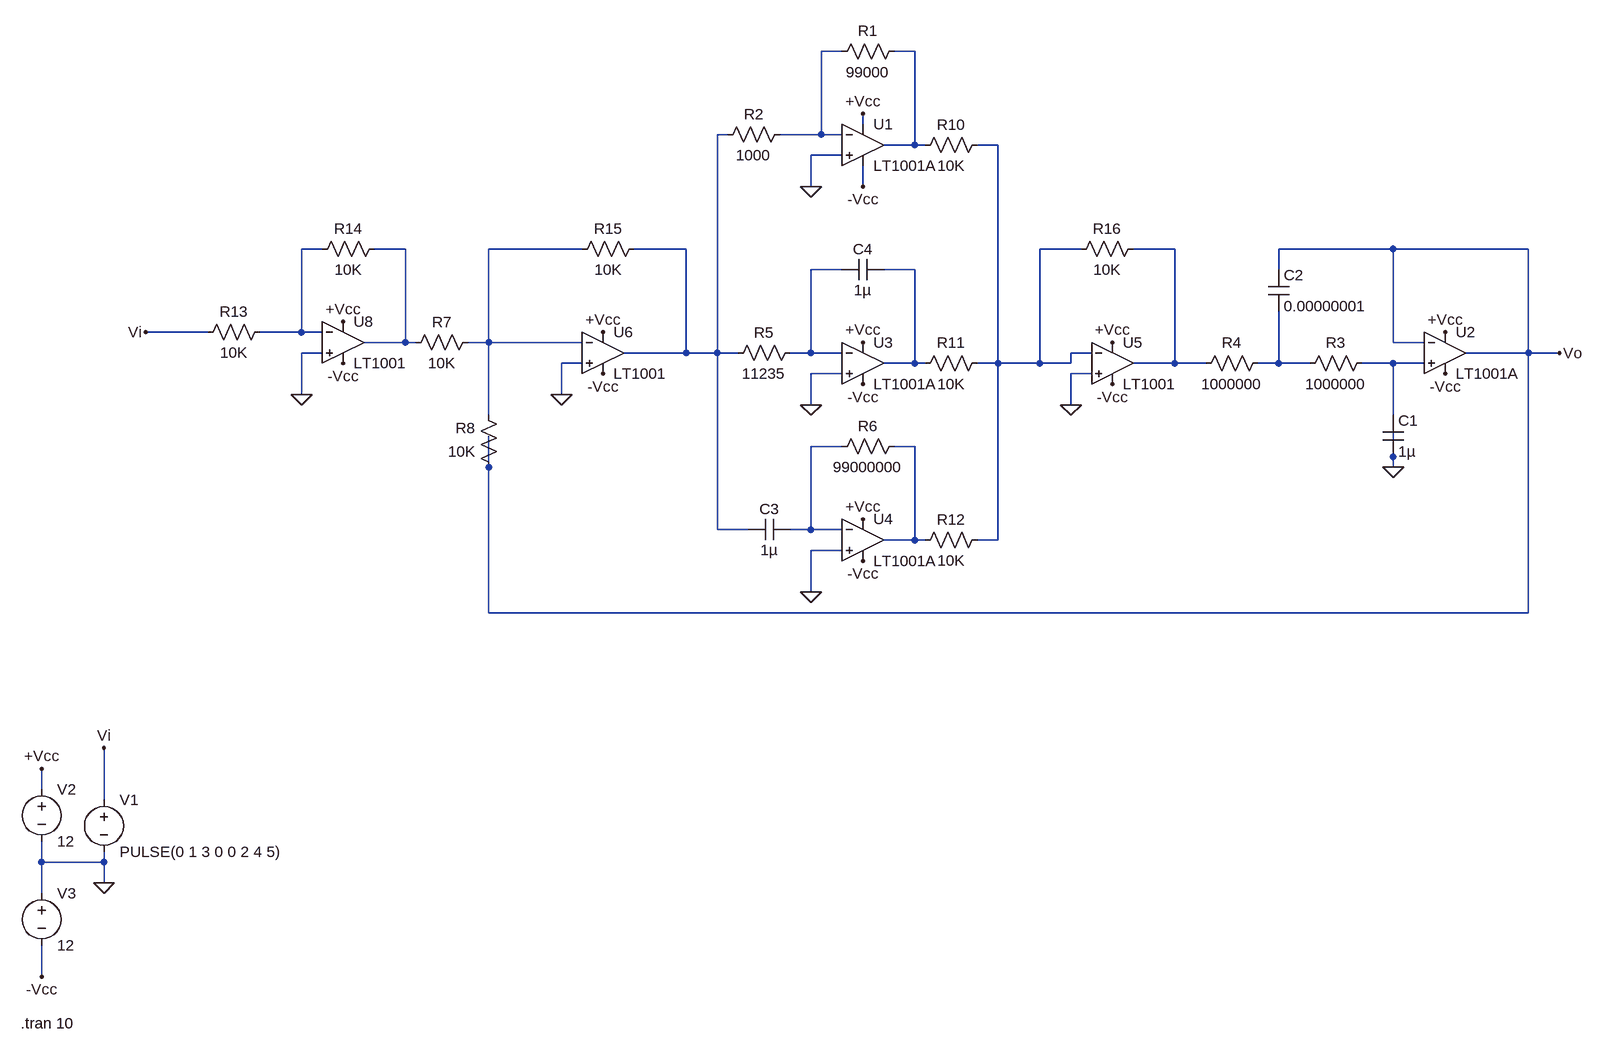
[diagram p0: schematic Circuitos_PID.asc]
Circuitos_PID.asc, the LTspice schematic file:
Version 4
SHEET 1 1532 1424
WIRE -576 -96 -608 -96
WIRE -464 -96 -496 -96
WIRE -544 16 -544 0
WIRE -752 32 -768 32
WIRE -608 32 -608 -96
WIRE -608 32 -672 32
WIRE -576 32 -608 32
WIRE -464 48 -464 -96
WIRE -464 48 -512 48
WIRE -448 48 -464 48
WIRE -336 48 -368 48
WIRE -576 64 -624 64
WIRE -624 112 -624 64
WIRE -544 112 -544 80
WIRE -1376 208 -1408 208
WIRE -1248 208 -1296 208
WIRE -976 208 -1120 208
WIRE -816 208 -896 208
WIRE -208 208 -272 208
WIRE -64 208 -128 208
WIRE 272 208 96 208
WIRE 480 208 272 208
WIRE -576 240 -624 240
WIRE -464 240 -512 240
WIRE 96 240 96 208
WIRE -1552 336 -1648 336
WIRE -1408 336 -1408 208
WIRE -1408 336 -1472 336
WIRE -1376 336 -1408 336
WIRE -1248 352 -1248 208
WIRE -1248 352 -1312 352
WIRE -1232 352 -1248 352
WIRE -1120 352 -1120 208
WIRE -1120 352 -1152 352
WIRE -976 352 -1120 352
WIRE 272 352 272 208
WIRE 320 352 272 352
WIRE -1376 368 -1408 368
WIRE -816 368 -816 208
WIRE -816 368 -912 368
WIRE -768 368 -768 32
WIRE -768 368 -816 368
WIRE -736 368 -768 368
WIRE -624 368 -624 240
WIRE -624 368 -656 368
WIRE -576 368 -624 368
WIRE -192 368 -224 368
WIRE 480 368 480 208
WIRE 480 368 384 368
WIRE 528 368 480 368
WIRE -976 384 -1008 384
WIRE -464 384 -464 240
WIRE -464 384 -512 384
WIRE -448 384 -464 384
WIRE -336 384 -336 48
WIRE -336 384 -368 384
WIRE -272 384 -272 208
WIRE -272 384 -336 384
WIRE -224 384 -224 368
WIRE -224 384 -272 384
WIRE -64 384 -64 208
WIRE -64 384 -128 384
WIRE -16 384 -64 384
WIRE 96 384 96 304
WIRE 96 384 64 384
WIRE 144 384 96 384
WIRE 272 384 224 384
WIRE 320 384 272 384
WIRE -576 400 -624 400
WIRE -192 400 -224 400
WIRE -1408 432 -1408 368
WIRE -1008 432 -1008 384
WIRE -624 448 -624 400
WIRE -224 448 -224 400
WIRE -1120 464 -1120 352
WIRE 272 464 272 384
WIRE -576 512 -624 512
WIRE -464 512 -496 512
WIRE 272 528 272 480
WIRE -1120 544 -1120 496
WIRE 272 544 272 528
WIRE -768 640 -768 368
WIRE -720 640 -768 640
WIRE -624 640 -624 512
WIRE -624 640 -656 640
WIRE -576 640 -624 640
WIRE -464 656 -464 512
WIRE -464 656 -512 656
WIRE -448 656 -464 656
WIRE -336 656 -336 384
WIRE -336 656 -368 656
WIRE -576 672 -624 672
WIRE -624 736 -624 672
WIRE -1120 768 -1120 544
WIRE 480 768 480 368
WIRE 480 768 -1120 768
WIRE -1808 1040 -1808 1008
WIRE -1712 1056 -1712 976
WIRE -1808 1152 -1808 1120
WIRE -1712 1152 -1712 1136
WIRE -1712 1152 -1808 1152
WIRE -1712 1184 -1712 1152
WIRE -1808 1200 -1808 1152
WIRE -1808 1328 -1808 1280
FLAG -624 112 0
FLAG -1712 1184 0
FLAG -1808 1008 +Vcc
FLAG -1808 1328 -Vcc
FLAG -544 0 +Vcc
FLAG -544 112 -Vcc
FLAG 352 336 +Vcc
FLAG 352 400 -Vcc
FLAG -624 448 0
FLAG -624 736 0
FLAG -544 352 +Vcc
FLAG -544 624 +Vcc
FLAG -544 416 -Vcc
FLAG -544 688 -Vcc
FLAG -224 448 0
FLAG -160 352 +Vcc
FLAG -160 416 -Vcc
FLAG -944 336 +Vcc
FLAG -944 400 -Vcc
FLAG -1008 432 0
FLAG -1408 432 0
FLAG -1648 336 Vi
FLAG 528 368 Vo
FLAG -1712 976 Vi
FLAG -1344 320 +Vcc
FLAG -1344 384 -Vcc
FLAG 272 544 0
SYMBOL OpAmps\\LT1001A -544 -16 R0
SYMATTR InstName U1
SYMBOL res -480 -112 R90
WINDOW 0 0 56 VBottom 2
WINDOW 3 32 56 VTop 2
SYMATTR InstName R1
SYMATTR Value 99000
SYMBOL res -656 16 R90
WINDOW 0 0 56 VBottom 2
WINDOW 3 32 56 VTop 2
SYMATTR InstName R2
SYMATTR Value 1000
SYMBOL voltage -1712 1040 R0
WINDOW 123 0 0 Left 0
WINDOW 39 0 0 Left 0
SYMATTR InstName V1
SYMATTR Value PULSE(0 1 3 0 0 2 4 5)
SYMBOL voltage -1808 1024 R0
WINDOW 123 0 0 Left 0
WINDOW 39 0 0 Left 0
SYMATTR InstName V2
SYMATTR Value 12
SYMBOL voltage -1808 1184 R0
WINDOW 123 0 0 Left 0
WINDOW 39 0 0 Left 0
SYMATTR InstName V3
SYMATTR Value 12
SYMBOL OpAmps\\LT1001A 352 304 R0
SYMATTR InstName U2
SYMBOL res 240 368 R90
WINDOW 0 0 56 VBottom 2
WINDOW 3 32 56 VTop 2
SYMATTR InstName R3
SYMATTR Value 1000000
SYMBOL res 80 368 R90
WINDOW 0 0 56 VBottom 2
WINDOW 3 32 56 VTop 2
SYMATTR InstName R4
SYMATTR Value 1000000
SYMBOL cap 256 464 R0
SYMATTR InstName C1
SYMATTR Value 1µ
SYMBOL cap 80 240 R0
SYMATTR InstName C2
SYMATTR Value 0.00000001
SYMBOL OpAmps\\LT1001A -544 320 R0
SYMATTR InstName U3
SYMBOL OpAmps\\LT1001A -544 592 R0
SYMATTR InstName U4
SYMBOL res -640 352 R90
WINDOW 0 0 56 VBottom 2
WINDOW 3 32 56 VTop 2
SYMATTR InstName R5
SYMATTR Value 11235
SYMBOL cap -656 624 R90
WINDOW 0 0 32 VBottom 2
WINDOW 3 32 32 VTop 2
SYMATTR InstName C3
SYMATTR Value 1µ
SYMBOL res -480 496 R90
WINDOW 0 0 56 VBottom 2
WINDOW 3 32 56 VTop 2
SYMATTR InstName R6
SYMATTR Value 99000000
SYMBOL cap -512 224 R90
WINDOW 0 0 32 VBottom 2
WINDOW 3 32 32 VTop 2
SYMATTR InstName C4
SYMATTR Value 1µ
SYMBOL OpAmps\\LT1001 -160 320 R0
SYMATTR InstName U5
SYMBOL OpAmps\\LT1001 -944 304 R0
SYMATTR InstName U6
SYMBOL res -1136 336 R90
WINDOW 0 0 56 VBottom 2
WINDOW 3 32 56 VTop 2
SYMATTR InstName R7
SYMATTR Value 10K
SYMBOL res -1104 560 R180
WINDOW 0 36 76 Left 2
WINDOW 3 36 40 Left 2
SYMATTR InstName R8
SYMATTR Value 10K
SYMBOL res -352 32 R90
WINDOW 0 0 56 VBottom 2
WINDOW 3 32 56 VTop 2
SYMATTR InstName R10
SYMATTR Value 10K
SYMBOL res -352 368 R90
WINDOW 0 0 56 VBottom 2
WINDOW 3 32 56 VTop 2
SYMATTR InstName R11
SYMATTR Value 10K
SYMBOL res -352 640 R90
WINDOW 0 0 56 VBottom 2
WINDOW 3 32 56 VTop 2
SYMATTR InstName R12
SYMATTR Value 10K
SYMBOL OpAmps\\LT1001 -1344 288 R0
SYMATTR InstName U8
SYMBOL res -1456 320 R90
WINDOW 0 0 56 VBottom 2
WINDOW 3 32 56 VTop 2
SYMATTR InstName R13
SYMATTR Value 10K
SYMBOL res -1280 192 R90
WINDOW 0 0 56 VBottom 2
WINDOW 3 32 56 VTop 2
SYMATTR InstName R14
SYMATTR Value 10K
SYMBOL res -880 192 R90
WINDOW 0 0 56 VBottom 2
WINDOW 3 32 56 VTop 2
SYMATTR InstName R15
SYMATTR Value 10K
SYMBOL res -112 192 R90
WINDOW 0 0 56 VBottom 2
WINDOW 3 32 56 VTop 2
SYMATTR InstName R16
SYMATTR Value 10K
TEXT -1840 1400 Left 2 !.tran 10

The netlist it stands for:
* Circuitos_PID.asc
XU1 0 N001 +Vcc -Vcc N002 LT1001  ; LT1001A, pins In+ In- V+ V- OUT
R1 N002 N001 99000
R2 N001 N003 1000
V1 Vi 0 PULSE(0 1 3 0 0 2 4 5)
V2 +Vcc 0 12
V3 0 -Vcc 12
XU2 N012 Vo +Vcc -Vcc Vo LT1001  ; LT1001A, pins In+ In- V+ V- OUT
R3 N012 N011 1000000
R4 N011 N008 1000000
C1 N012 0 1µ
C2 Vo N011 0.00000001
XU3 0 N009 +Vcc -Vcc N010 LT1001  ; LT1001A, pins In+ In- V+ V- OUT
XU4 0 N013 +Vcc -Vcc N014 LT1001  ; LT1001A, pins In+ In- V+ V- OUT
R5 N009 N003 11235
C3 N013 N003 1µ
R6 N014 N013 99000000
C4 N010 N009 1µ
XU5 0 N004 +Vcc -Vcc N008 LT1001  ; pins In+ In- V+ V- OUT
XU6 0 N007 +Vcc -Vcc N003 LT1001  ; pins In+ In- V+ V- OUT
R7 N007 N006 10K
R8 Vo N007 10K
R10 N004 N002 10K
R11 N004 N010 10K
R12 N004 N014 10K
XU8 0 N005 +Vcc -Vcc N006 LT1001  ; pins In+ In- V+ V- OUT
R13 N005 Vi 10K
R14 N006 N005 10K
R15 N003 N007 10K
R16 N008 N004 10K
.tran 10
.lib LTC.lib
.backanno
.end